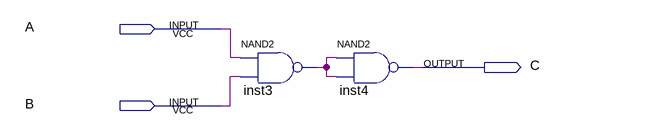
[diagram p0: schematic sheet]
// Quartus schematic and_nand2.bdf as structural Verilog: 2 symbols, 3 pins
module and_nand2 (
  input  A,
  input  B,
  output C
);

  wire inst3_out;

  nand inst3 (inst3_out, A, B);
  nand inst4 (C, inst3_out, inst3_out);
endmodule
